# Altium project ECE295 Test Board.PrjPcb
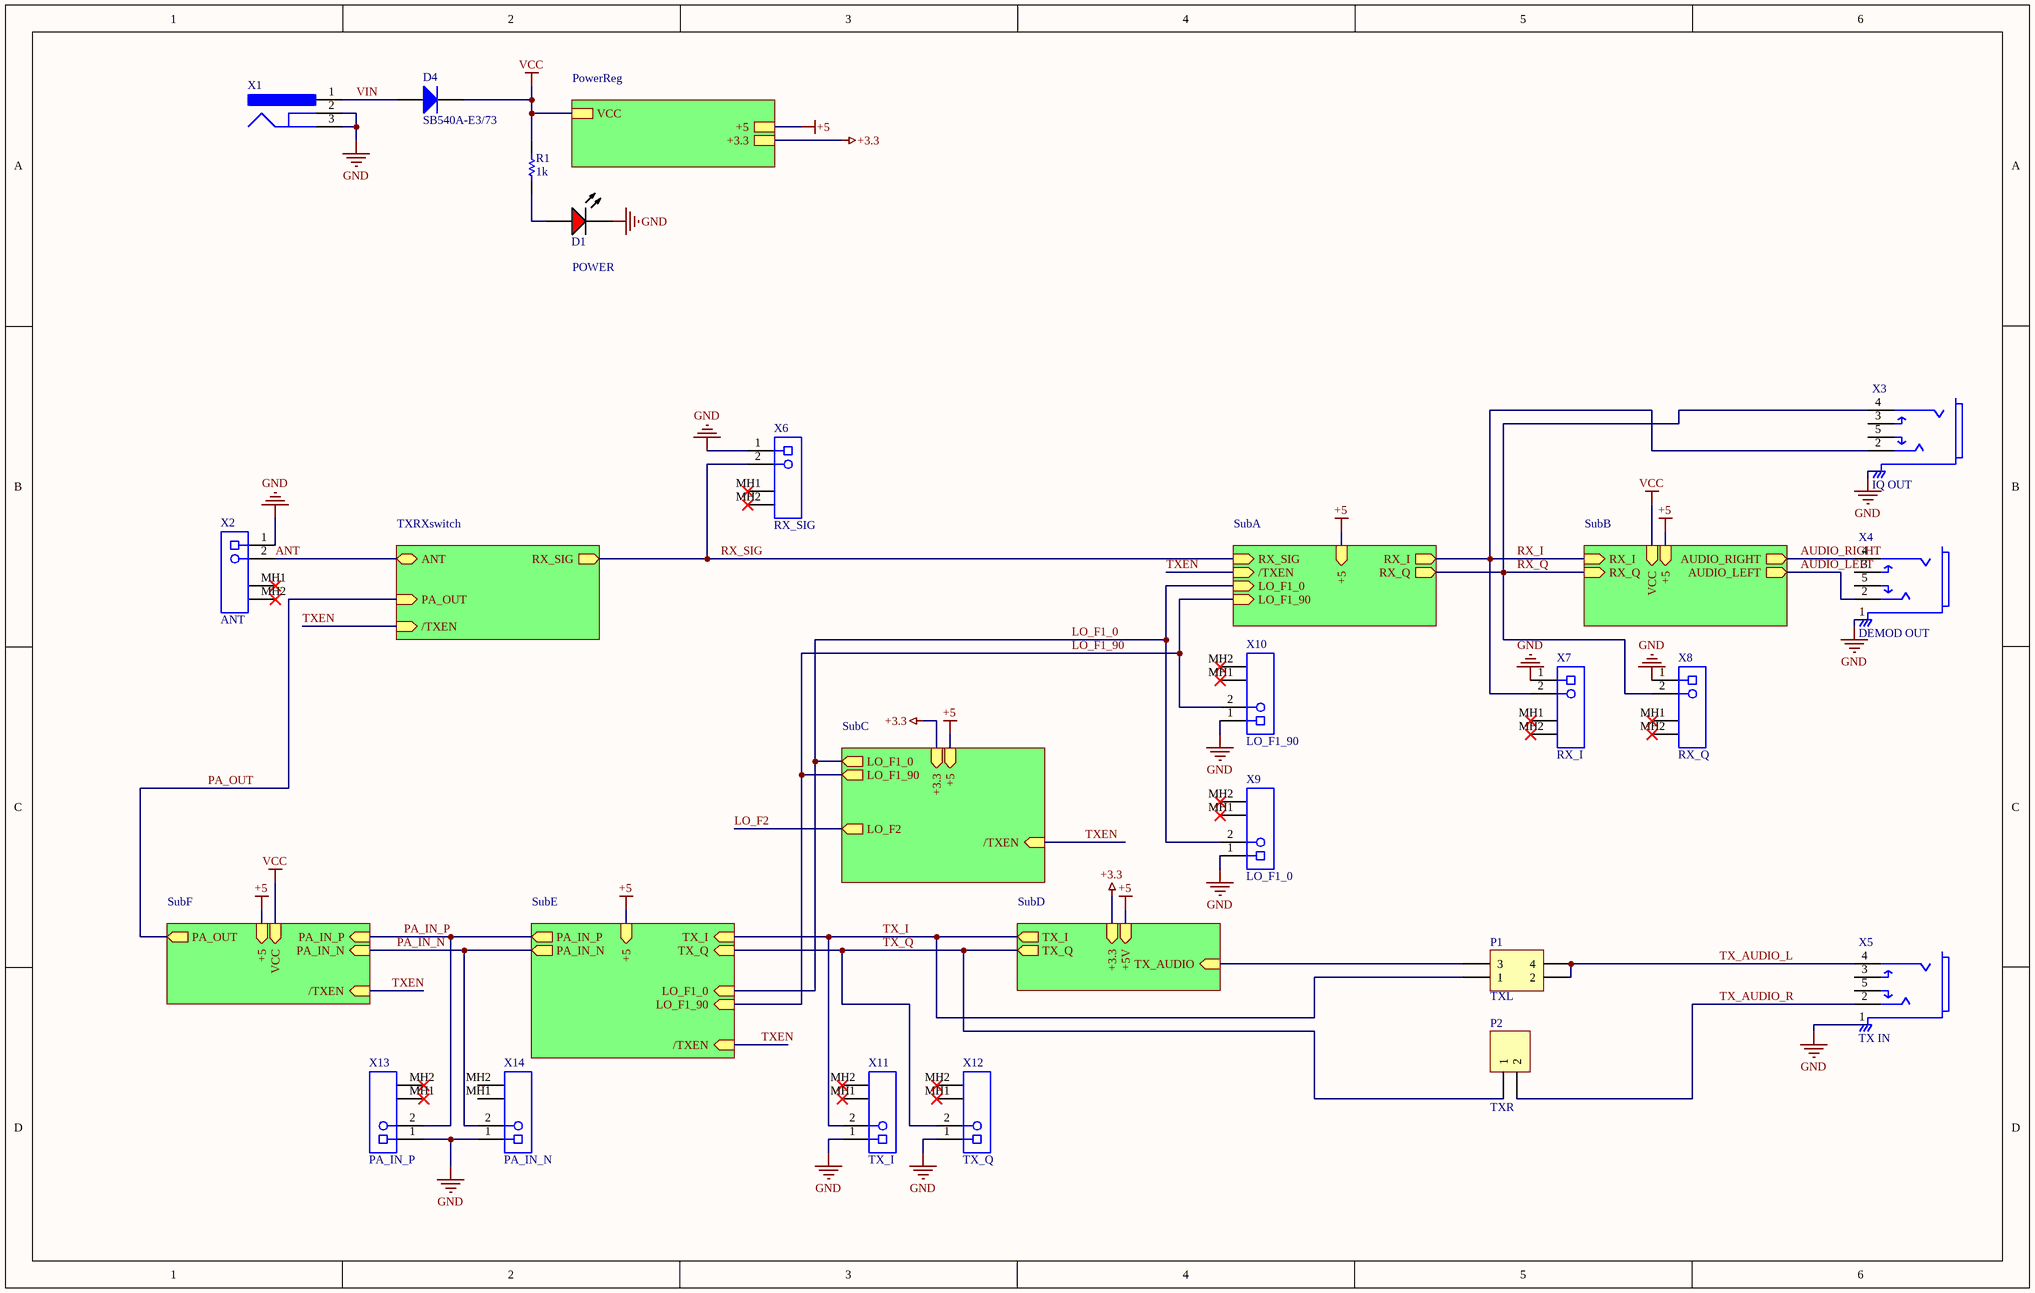
[diagram p0: top_blank.SchDoc]
8 sheets, 39 parts. Net scope: hierarchical (ports join the sheet entries above them; power ports are global).
Board files: top_blank.PcbDoc, demod_blank.PcbDoc, qse_blank.PcbDoc, pa_blank.PcbDoc, osc_blank.PcbDoc, rxall_blank.PcbDoc, modulator.PcbDoc
Sheets:
  top_blank.SchDoc
    SubB = demod_blank.SchDoc
    SubC = osc_blank.SchDoc
    SubF = pa_blank.SchDoc
    SubE = qse_blank.SchDoc
    PowerReg = power_intg.SchDoc
    SubA = rxall_blank.SchDoc
    SubD = modulator.SchDoc

## Sheet top_blank.SchDoc
size 381 x 241 mm; SheetNumber: 1; SheetTotal: 9

### Parts
D1  POWER  [AVAG-HLMP-3301-2]
D4  SB540A-E3/73  [DO-201AD]
P1  TXL  [HDR2X2]
P2  TXR  [HDR1X2]
R1  value 1k  [AXIAL-0.4]  (hidden comment: Res1)
X1  PJ-002A  [CUI-PJ-002A_V]  (value not drawn)
X2  ANT  [TECO-1-1337543-0_V]
X3  IQ OUT  [FP-35RAPC4BV4-MFG]
X4  DEMOD OUT  [FP-35RAPC4BV4-MFG]
X5  TX IN  [FP-35RAPC4BV4-MFG]
X6  RX_SIG  [TECO-1-1337543-0_V]
X7  RX_I  [TECO-1-1337543-0_V]
X8  RX_Q  [TECO-1-1337543-0_V]
X9  LO_F1_0  [TECO-1-1337543-0_V]
X10  LO_F1_90  [TECO-1-1337543-0_V]
X11  TX_I  [TECO-1-1337543-0_V]
X12  TX_Q  [TECO-1-1337543-0_V]
X13  PA_IN_P  [TECO-1-1337543-0_V]
X14  PA_IN_N  [TECO-1-1337543-0_V]

### Sub-sheets
PowerReg = power_intg.SchDoc: VCC, +3.3, +5
SubA = rxall_blank.SchDoc: RX_SIG (in), /TXEN (in), LO_F1_0 (in), LO_F1_90 (in), RX_I (out), +5 (in), RX_Q (out)
SubB = demod_blank.SchDoc: AUDIO_LEFT (out), AUDIO_RIGHT (out), +5 (in), RX_Q (in), RX_I (in), VCC (in)
SubC = osc_blank.SchDoc: /TXEN (in), LO_F1_0 (out), LO_F1_90 (out), LO_F2 (out), +5 (in), +3.3 (in)
SubD = modulator.SchDoc: TX_AUDIO (in), TX_I (out), TX_Q (out), +3.3 (in), +5V (in)
SubE = qse_blank.SchDoc: TX_I (in), TX_Q (in), /TXEN (in), LO_F1_0 (in), LO_F1_90 (in), +5 (in), PA_IN_P (out), PA_IN_N (out)
SubF = pa_blank.SchDoc: PA_OUT (out), /TXEN (in), +5 (in), VCC (in), PA_IN_P (in), PA_IN_N (in)
TXRXswitch = switch_blank.SchDoc (file not in this document): ANT (bidir), RX_SIG (out), /TXEN (in), PA_OUT (in)

### Nets
+3.3: sheet SubC/+3.3, sheet PowerReg/+3.3, sheet SubD/+3.3
+5: sheet SubB/+5, sheet SubC/+5, sheet SubF/+5, sheet SubE/+5, sheet PowerReg/+5, sheet SubA/+5, sheet SubD/+5V
GND: D1.1(K) X1.2 X1.3 X2.1 X3.1 X4.1 X5.1 X6.1 X7.1 X8.1 X9.1 X10.1 X11.1 X12.1 X13.1 X14.1
VCC: D4.2(K) R1.2 ; sheet SubB/VCC, sheet SubF/VCC, sheet PowerReg/VCC
ANT: X2.2 ; sheet TXRXswitch/ANT
AUDIO_LEFT: X4.2 ; sheet SubB/AUDIO_LEFT
AUDIO_RIGHT: X4.4 ; sheet SubB/AUDIO_RIGHT
LO_F1_0: X9.2 ; sheet SubC/LO_F1_0, sheet SubE/LO_F1_0, sheet SubA/LO_F1_0
LO_F1_90: X10.2 ; sheet SubC/LO_F1_90, sheet SubE/LO_F1_90, sheet SubA/LO_F1_90
PA_IN_N: X14.2 ; sheet SubF/PA_IN_N, sheet SubE/PA_IN_N
PA_IN_P: X13.2 ; sheet SubF/PA_IN_P, sheet SubE/PA_IN_P
PA_OUT: sheet SubF/PA_OUT, sheet TXRXswitch/PA_OUT
RX_I: X3.2 X7.2 ; sheet SubB/RX_I, sheet SubA/RX_I
RX_Q: X3.4 X8.2 ; sheet SubB/RX_Q, sheet SubA/RX_Q
RX_SIG: X6.2 ; sheet SubA/RX_SIG, sheet TXRXswitch/RX_SIG
TX_AUDIO_L: P1.2 P1.4 X5.4
TX_AUDIO_R: P2.2 X5.2
TX_I: P1.1 X11.2 ; sheet SubE/TX_I, sheet SubD/TX_I
TX_Q: P2.1 X12.2 ; sheet SubE/TX_Q, sheet SubD/TX_Q
TXEN: sheet SubC//TXEN, sheet SubF//TXEN, sheet SubE//TXEN, sheet SubA//TXEN, sheet TXRXswitch//TXEN
VIN: D4.1(A) X1.1
NetD1_2: D1.2(A) R1.1
NetJ8_1: P1.3 ; sheet SubD/TX_AUDIO

Not connected (* = marked no-connect by the designer): X2 MH1* MH2*; X3 3 5; X4 3 5; X5 3 5; X6 MH1* MH2*; X7 MH1* MH2*; X8 MH1* MH2*; X9 MH1* MH2*; X10 MH1* MH2*; X11 MH1* MH2*; X12 MH1* MH2*; X13 MH1* MH2*; X14 MH1 MH2

### Library data of the parts
D1 = CMP-2000-06411-1: T-1 3/4 (5 mm) Diffused LED Lamp, 1.9 V, -40 to 100 degC, 2-Pin THD, RoHS, Bulk; Manufacturer: Avago; Forward Current: 25mA; Forward Voltage: 2.4V; Peak Wavelength: 635nm; Shape Type: Circular; High Brightness: No; Main Category: StandardLED; Test Current (It): 10mA; Dominant Wave Length: 626nm; Number of  Elements: 1; Reverse Voltage: 5V; Chip Material: GaP; Product Height (mm): 9.19mm; Lens Type: ColoredDiffused; Viewing Angle: 60deg; Type: Uni-Color; Emitting Color: Red; Luminous Intensity: 5.4mcd; Power Dissipation: 85W; DELETED: Compliant; Product Depth (mm): 6.1mm; Package Description: 2-Pin Through Hole LED, Dia 5.85 mm; Mounting Technology: ThroughHole; Manufacturer URL: http://www.avagotech.com/; Package Type: T-13/4; Operating Temp Range: -40Cto100C; Datasheet URL: http://www.avagotech.com/docs/AV02-1558EN; Mounting: ThroughHole; Lens Dimensions: 5.08x5.08x8.3mm; Package Reference: HLMP-3301; Datasheet Version: 03/2015; Pin Count: 2; Packaging: TapeandReel; Operating Temperature Classification: Industrial; Lum Intensity: 5.4mcd; Rad Hardened: No; Product Length (mm): 6.1mm
D4 = Diode 1N5408: 3 Amp Medium Power Silicon Rectifier Diode; Published: 8-Jun-2000; LatestRevisionDate: 17-Jul-2002; LatestRevisionNote: Re-released for DXP Platform.; DatasheetVersion: Aug-1984; PackageReference: DO-201AD; Publisher: Altium Limited; PackageDescription: Diode, Axial; Body 9.5 x 5.3 mm (LxDia. max), Lead Dia. 1.32 mm (max); ComponentLink1Description: Manufacturer Link; ComponentLink1URL: http://www.irf.com/
P1 = Header 2X2: Header, 2-Pin, Dual row; LatestRevisionDate: 17-Jul-2002; LatestRevisionNote: Re-released for DXP Platform.; Publisher: Altium Limited
P2 = Header 2: Header, 2-Pin; LatestRevisionDate: 17-Jul-2002; LatestRevisionNote: Re-released for DXP Platform.; Publisher: Altium Limited
R1 = Res1: Resistor; Published: 8-Jun-2000; LatestRevisionDate: 17-Jul-2002; LatestRevisionNote: Re-released for DXP Platform.; PackageReference: AXIAL-0.3; Publisher: Altium Limited; PackageDescription: Axial Device, Thru-Hole; 2 Leads; 0.3 in Pin Spacing
X1 = CMP-2000-06895-1: Through Hole Right Angle DC Power Jack, 2.5 A, 2 mm Center Pin, 3 Position, -25 to 85 degC, RoHS, Bulk; Manufacturer: CUIInc.; Current Rating: 2.5A; Inside Contact Diameter: 2mm; Insulation Resistance: 50MOhms; Outside Contact Diameter: 6.5mm; Voltage Rating: 24V; Brand: CUI; Operating Temperature Range: -25Cto+85C; Mounting Technology: ThroughHole; Connector Type: DCPowerJack; Contact Material: Copper; Datasheet URL: http://www.cui.com/product/resource/pj-002a.pdf; Contact Gender: Male; Housing Material: PolybutyleneTerephthalate(PBT); Manufacturer URL: http://www.cui.com/; Package Reference: PJ-002A; Mounting Style: ThroughHole; Mounting Angle: Right; Product Category: DCPowerConnectors; Product: Jacks; Flammability Rating: UL94V-0; Contact Plating: Nickel; RoHS: True; Datasheet Version: Rev. 1.03, 04/2016; Package Description: 3-Pin Through Hole Device, Body 14.4 x 9 mm, Height 11 mm; Factory Pack Quantity: 500; Termination Style: ThroughHole
X2 X6-X14 = CMP-2000-05853-1: Female Connector, Pitch 2.54 mm, 1 x 2 Position, Height 15.8 mm, Tail Length 3.8 mm, / -55 to 85 degC, RoHS, Bulk; Manufacturer: TE Connectivity; Connector Body Style: RightAngleJack; Frequency Max: 4GHz; Coaxial Termination: Solder; Connector Mounting: PCBMount; SVHC: ToBeAdvised; Connector Type: BNCCoaxial; Impedance: 50ohm; Coaxial Cable Types: -; Manufacturer URL: http://www.te.com/; Package Reference: 1-1337543-0; Product Range: -; Datasheet URL: http://www.te.com/commerce/DocumentDelivery/DDEController?Action=showdoc&DocId=Customer+Drawing%7F1337543%7FG%7Fpdf%7FEnglish%7FENG_CD_1337543_G.pdf%7F1-1337543-0; Contact Plating: GoldPlatedContacts; Mounting Technology: ThroughHole; Package Description: Female Connector, Pitch 2.54 mm, 1 x 2 Position, Height 15.8 mm, Tail Length 3.8 mm; Contact Material: Brass; Datasheet Version: Rev. G, 12/2012
X3-X5 = CMP-47983-000001-1: CONN JACK STEREO 3.5MM R/A; Manufacturer: Switchcraft; Obsolete Part: true; Manufacturer Part Number: 35RAPC4BV4; Conn Orientation: Right Angle; Number Of Contacts: 5; Contact Material: Silver; Device Class L1: Connectors; Height: 0.495inch; ComponentLink2URL: http://www.switchcraft.com/Drawings/35rapc__v4_cd.pdf; Category: Conn; Digikey Description: CONN JACK STEREO 3.5MM R/A; Automotive: No; ComponentLink2Description: Datasheet; Package: 35RAPC4BV4; Device Class L2: Audio / Video Connectors; Mouser Description: Phone Connectors 3.5MM VERT STEREO JK; RoHS: TRUE; Octopart: https://octopart.com/35rapc4bv4-switchcraft-223606; Lead Free: Yes; Device Class L3: unset

## Sheet demod_blank.SchDoc
size Letter; SheetNumber: 13; SheetTotal: 13
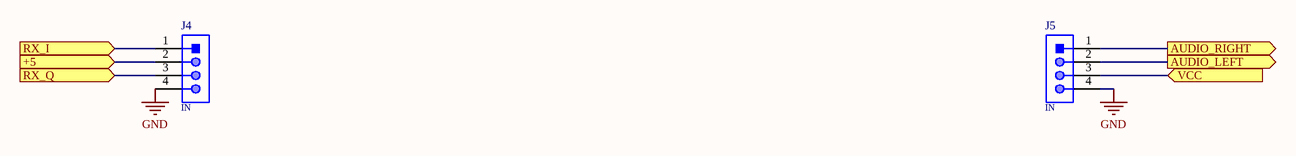
[diagram p1: demod_blank.SchDoc]

### Parts
(Parts that share a designator on the sheet are numbered #1, #2 ... from top to bottom, then left to right.)
J4  IN  [61300411121]
J5#1  IN  [61300411121]

### Ports
+5 (in), AUDIO_LEFT (out), AUDIO_RIGHT (out), RX_I (in), RX_Q (in), VCC (in)

### Nets
+5: J4.2 ; port +5
GND: J4.4 J5#1.4
VCC: J5#1.3 ; port VCC
AUDIO_LEFT: J5#1.2 ; port AUDIO_LEFT
AUDIO_RIGHT: J5#1.1 ; port AUDIO_RIGHT
RX_I: J4.1 ; port RX_I
RX_Q: J4.3 ; port RX_Q

### Library data of the parts
J4 J5#1 = CMP-1502-01064-1: THT Vertical Pin Header WR-PHD, Pitch 2.54 mm, Single Row, 4 pins; Manufacturer: Wurth Elektronik; Withstanding Voltage: 500VAC; Rated Current: 3A; Working Voltage: 250VAC; Pin Number: 4; Gender: Male; Contact Resistance: 20mOhm; Pitch: 2.54mm; Manufacturer URL: http://www.we-online.de; Operating Temperature: -40to105degC; Packaging: Bag; Mounting Technology: THT; Package Reference: 61300411121; Datasheet URL: https://katalog.we-online.de/em/datasheet/6130xx11121.pdf; Publisher: WurthElektronik; Part Number: 61300411121; Row Number: Single; Orientation: Vertical

## Sheet osc_blank.SchDoc
size Letter; SheetNumber: 5; SheetTotal: 9
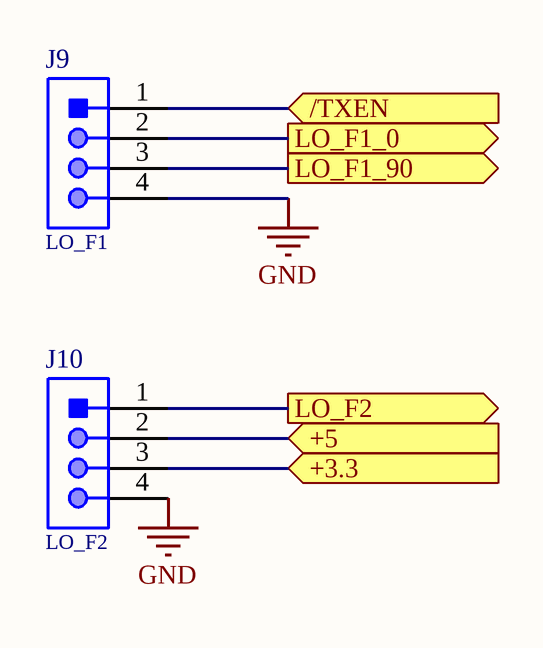
[diagram p2: osc_blank.SchDoc]

### Parts
(Parts that share a designator on the sheet are numbered #1, #2 ... from top to bottom, then left to right.)
J9#1  LO_F1  [61300411121]
J10#1  LO_F2  [61300411121]

### Ports
+3.3 (in), +5 (in), /TXEN (in), LO_F1_0 (out), LO_F1_90 (out), LO_F2 (out)

### Nets
+3.3: J10#1.3 ; port +3.3
+5: J10#1.2 ; port +5
GND: J9#1.4 J10#1.4
LO_F1_0: J9#1.2 ; port LO_F1_0
LO_F1_90: J9#1.3 ; port LO_F1_90
LO_F2: J10#1.1 ; port LO_F2
TXEN: J9#1.1 ; port /TXEN

### Library data of the parts
J9#1 J10#1 = CMP-1502-01064-1: as J4 on sheet demod_blank; Manufacturer URL: http://www.we-online.de; Operating Temperature: -40to105degC; Packaging: Bag; Mounting Technology: THT; Package Reference: 61300411121; Datasheet URL: https://katalog.we-online.de/em/datasheet/6130xx11121.pdf; Publisher: WurthElektronik; Part Number: 61300411121; Row Number: Single; Orientation: Vertical

## Sheet pa_blank.SchDoc
size Letter; SheetNumber: 16; SheetTotal: 16
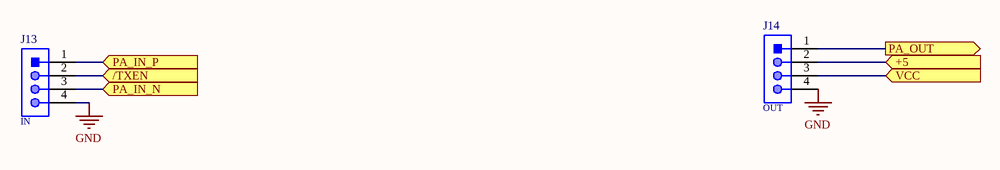
[diagram p3: pa_blank.SchDoc]

### Parts
J13  IN  [61300411121]
J14  OUT  [61300411121]

### Ports
+5 (in), /TXEN (in), PA_IN_N (in), PA_IN_P (in), PA_OUT (out), VCC (in)

### Nets
+5: J14.2 ; port +5
GND: J13.4 J14.4
VCC: J14.3 ; port VCC
PA_IN_N: J13.3 ; port PA_IN_N
PA_IN_P: J13.1 ; port PA_IN_P
PA_OUT: J14.1 ; port PA_OUT
TXEN: J13.2 ; port /TXEN

### Library data of the parts
J13 J14 = CMP-1502-01064-1: as J4 on sheet demod_blank; Manufacturer URL: http://www.we-online.de; Operating Temperature: -40to105degC; Packaging: Bag; Mounting Technology: THT; Package Reference: 61300411121; Datasheet URL: https://katalog.we-online.de/em/datasheet/6130xx11121.pdf; Publisher: WurthElektronik; Part Number: 61300411121; Row Number: Single; Orientation: Vertical

## Sheet qse_blank.SchDoc
size Letter; SheetNumber: 4; SheetTotal: 9
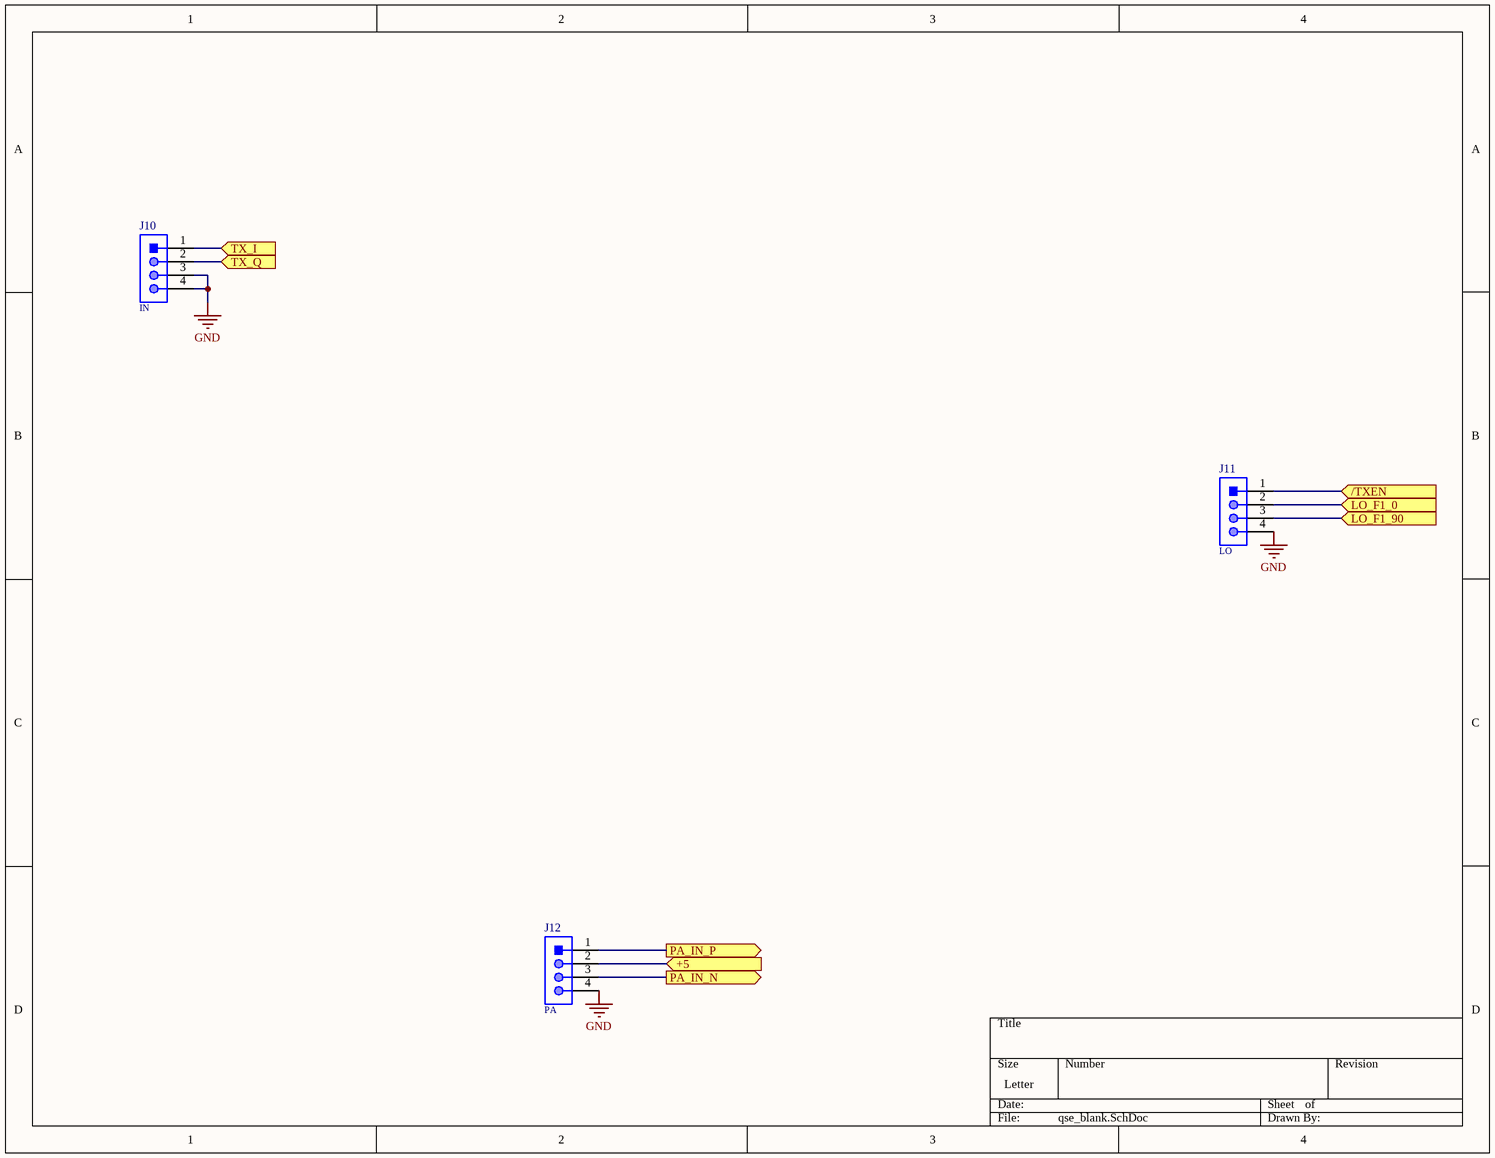
[diagram p4: qse_blank.SchDoc]

### Parts
(Parts that share a designator on the sheet are numbered #1, #2 ... from top to bottom, then left to right.)
J10#2  IN  [61300411121]
J11  LO  [61300411121]
J12  PA  [61300411121]

### Ports
+5 (in), /TXEN (in), LO_F1_0 (in), LO_F1_90 (in), PA_IN_N (out), PA_IN_P (out), TX_I (in), TX_Q (in)

### Nets
+5: J12.2 ; port +5
GND: J10#2.3 J10#2.4 J11.4 J12.4
LO_F1_0: J11.2 ; port LO_F1_0
LO_F1_90: J11.3 ; port LO_F1_90
PA_IN_N: J12.3 ; port PA_IN_N
PA_IN_P: J12.1 ; port PA_IN_P
TX_I: J10#2.1 ; port TX_I
TX_Q: J10#2.2 ; port TX_Q
TXEN: J11.1 ; port /TXEN

### Library data of the parts
J10#2 J11 J12 = CMP-1502-01064-1: as J4 on sheet demod_blank; Manufacturer URL: http://www.we-online.de; Operating Temperature: -40to105degC; Packaging: Bag; Mounting Technology: THT; Package Reference: 61300411121; Datasheet URL: https://katalog.we-online.de/em/datasheet/6130xx11121.pdf; Publisher: WurthElektronik; Part Number: 61300411121; Row Number: Single; Orientation: Vertical

## Sheet power_intg.SchDoc
size Letter
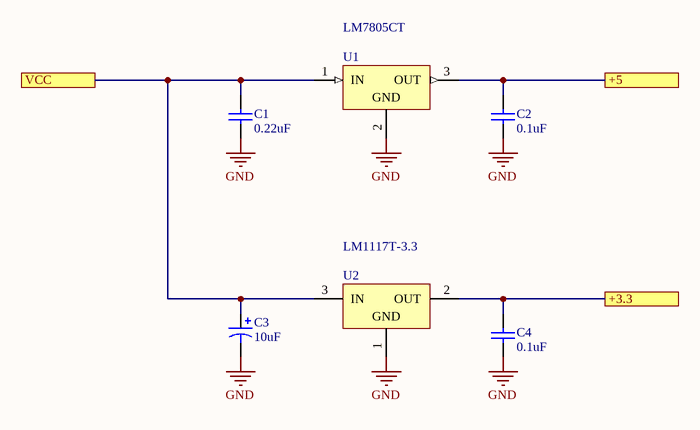
[diagram p5: power_intg.SchDoc]

### Parts
C1  value 0.22uF  [RAD-0.1]  (hidden comment: Cap)
C2  value 0.1uF  [RAD-0.1]  (hidden comment: Cap)
C3  value 10uF  [RAD-0.1]  (hidden comment: Cap Pol1)
C4  value 0.1uF  [RAD-0.1]  (hidden comment: Cap)
U1  LM7805CT  [FAIR-TO-220-3]
U2  LM1117T-3.3  [T03B]

### Ports
+3.3, +5, VCC

### Nets
+3.3: C4.1 U2.2(OUT) ; port +3.3
+5: C2.1 U1.3(OUT) ; port +5
GND: C1.2 C2.2 C3.2 C4.2 U1.2(GND) U2.1(GND)
VCC: C1.1 C3.1 U1.1(IN) U2.3(IN) ; port VCC

### Library data of the parts
C1 C2 C4 = Cap: Capacitor; Published: 8-Jun-2000; LatestRevisionDate: 17-Jul-2002; LatestRevisionNote: Re-released for DXP Platform.; PackageReference: RAD-0.3; Publisher: Altium Limited; PackageDescription: Radial Cap, Thru-Hole; 2 Leads; 0.3 in Pin Spacing
C3 = Cap Pol1: Polarized Capacitor (Radial); Published: 8-Jun-2000; LatestRevisionDate: 17-Jul-2002; LatestRevisionNote: Re-released for DXP Platform.; PackageReference: RB7.6-15; Publisher: Altium Limited; PackageDescription: Polarized Capacitor (Radial); 2 Leads
U1 = CMP-2000-04938-1: Positive Voltage Regulator, 5 V, 1 A, -40 to 125 degC, 3-Pin TO-220, RoHS, Tube; Manufacturer: FairchildSemiconductor; Maximum Input Voltage: 35V; Maximum Quiescent Current: 8mA; Load Regulation: 100mV; Maximum Output Current: 2.2(Typ)A; Output Type: Fixed; Typical Dropout Voltage @ Current: 2@1AV; Rad Hard: No; Output Voltage: 5V; Accuracy: ±4%; Number of Outputs: 1; Category: LinearRegulator; Package Description: 3-Pin Through Hole Device, Body 10 x 4.5 mm, Pitch 2.54 mm; Packaging: Rail/Tube; Mounting: ThroughHole; Polarity: Positive; Manufacturer URL: https://www.fairchildsemi.com/; Line Regulation: 100mV; Datasheet Version: Aug-12; Datasheet URL: https://datasheet.ciiva.com/26904/lm7805ct-26904988.pdf; Package Reference: TO-220; Package URL: https://www.fairchildsemi.com/package-drawings/TO/TO220B03.pdf; Package: 3TO-220AB; Operating Temperature: -40to125degC; Type: Linear
U2 = CMP-0062-02490-2: 800mA Low-Dropout Linear Regulator, 3-pin TO-220; Manufacturer: National Semiconductor; PowerWise: N; CompType: LDO IC; PackageTopMarking: NSUZXYTTE#*LM1117T*3.3; ComponentLink1Description: LM1117 Datasheet; RoHS: N; PinCount: 3; DatasheetVersion: Apr-2006; PackageDescription: TO-220, Molded, 3 Lead, Straight; ComponentLink2URL: http://www.national.com/pf/LM/LM1117.html; ComponentLink2Description: LM1117 Web Page; RevisionNote: Component URLs added; ComponentLink3Description: T03B Package Page; PackageReference: T03B; ComponentLink1URL: http://www.national.com/ds/LM/LM1117.pdf; PackageVersion: revL, Jan-1992; ComponentLink3URL: http://www.national.com/packaging/folders/t03b.html

## Sheet rxall_blank.SchDoc
size A4
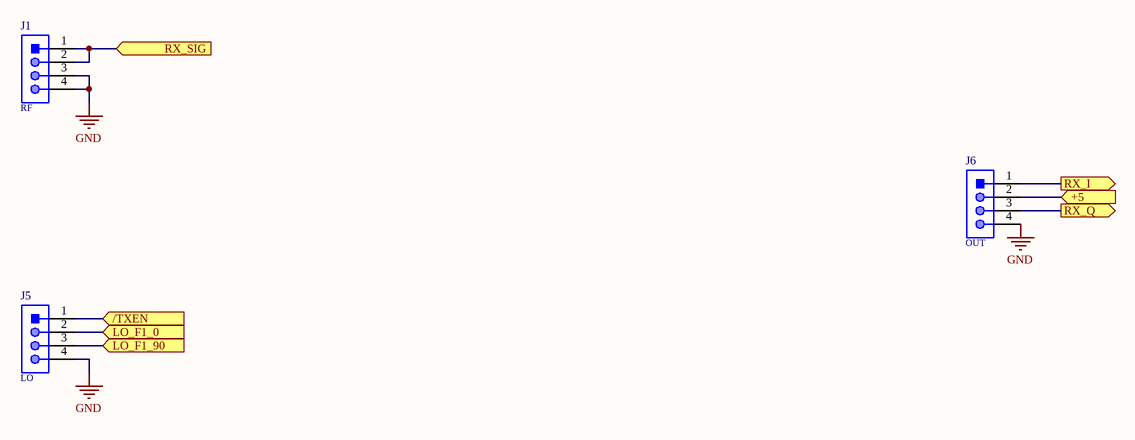
[diagram p6: rxall_blank.SchDoc]

### Parts
(Parts that share a designator on the sheet are numbered #1, #2 ... from top to bottom, then left to right.)
J1  RF  [61300411121]
J5#2  LO  [61300411121]
J6  OUT  [61300411121]

### Ports
+5 (in), /TXEN (in), LO_F1_0 (in), LO_F1_90 (in), RX_I (out), RX_Q (out), RX_SIG (in)

### Nets
+5: J6.2 ; port +5
GND: J1.3 J1.4 J5#2.4 J6.4
LO_F1_0: J5#2.2 ; port LO_F1_0
LO_F1_90: J5#2.3 ; port LO_F1_90
RX_I: J6.1 ; port RX_I
RX_Q: J6.3 ; port RX_Q
RX_SIG: J1.1 J1.2 ; port RX_SIG
TXEN: J5#2.1 ; port /TXEN

### Library data of the parts
J1 J5#2 J6 = CMP-1502-01064-1: as J4 on sheet demod_blank; Manufacturer URL: http://www.we-online.de; Operating Temperature: -40to105degC; Packaging: Bag; Mounting Technology: THT; Package Reference: 61300411121; Datasheet URL: https://katalog.we-online.de/em/datasheet/6130xx11121.pdf; Publisher: WurthElektronik; Part Number: 61300411121; Row Number: Single; Orientation: Vertical

## Sheet modulator.SchDoc
size A4
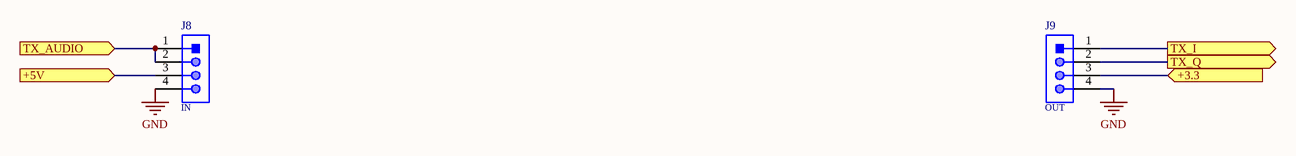
[diagram p7: modulator.SchDoc]

### Parts
(Parts that share a designator on the sheet are numbered #1, #2 ... from top to bottom, then left to right.)
J8  IN  [61300411121]
J9#2  OUT  [61300411121]

### Ports
+3.3 (in), +5V (in), TX_AUDIO (in), TX_I (out), TX_Q (out)

### Nets
+3.3: J9#2.3 ; port +3.3
+5: J8.3 ; port +5V
GND: J8.4 J9#2.4
TX_I: J9#2.1 ; port TX_I
TX_Q: J9#2.2 ; port TX_Q
NetJ8_1: J8.1 J8.2 ; port TX_AUDIO

### Library data of the parts
J8 J9#2 = CMP-1502-01064-1: as J4 on sheet demod_blank; Manufacturer URL: http://www.we-online.de; Operating Temperature: -40to105degC; Packaging: Bag; Mounting Technology: THT; Package Reference: 61300411121; Datasheet URL: https://katalog.we-online.de/em/datasheet/6130xx11121.pdf; Publisher: WurthElektronik; Part Number: 61300411121; Row Number: Single; Orientation: Vertical

## Nets that join several sheets
+3.3: osc_blank (J10#1.3), power_intg (C4.1 U2.2), modulator (J9#2.3)
+5: demod_blank (J4.2), osc_blank (J10#1.2), pa_blank (J14.2), qse_blank (J12.2), power_intg (C2.1 U1.3), rxall_blank (J6.2), modulator (J8.3)
GND: top_blank (16 pins), demod_blank (J4.4 J5#1.4), osc_blank (J9#1.4 J10#1.4), pa_blank (J13.4 J14.4), qse_blank (J10#2.3 J10#2.4 J11.4 J12.4), power_intg (6 pins), rxall_blank (J1.3 J1.4 J5#2.4 J6.4), modulator (J8.4 J9#2.4)
VCC: top_blank (D4.2 R1.2), demod_blank (J5#1.3), pa_blank (J14.3), power_intg (C1.1 C3.1 U1.1 U2.3)
AUDIO_LEFT: top_blank (X4.2), demod_blank (J5#1.2)
AUDIO_RIGHT: top_blank (X4.4), demod_blank (J5#1.1)
LO_F1_0: top_blank (X9.2), osc_blank (J9#1.2), qse_blank (J11.2), rxall_blank (J5#2.2)
LO_F1_90: top_blank (X10.2), osc_blank (J9#1.3), qse_blank (J11.3), rxall_blank (J5#2.3)
NetJ8_1: top_blank (P1.3), modulator (J8.1 J8.2)
PA_IN_N: top_blank (X14.2), pa_blank (J13.3), qse_blank (J12.3)
PA_IN_P: top_blank (X13.2), pa_blank (J13.1), qse_blank (J12.1)
RX_I: top_blank (X3.2 X7.2), demod_blank (J4.1), rxall_blank (J6.1)
RX_Q: top_blank (X3.4 X8.2), demod_blank (J4.3), rxall_blank (J6.3)
RX_SIG: top_blank (X6.2), rxall_blank (J1.1 J1.2)
TX_I: top_blank (P1.1 X11.2), qse_blank (J10#2.1), modulator (J9#2.1)
TX_Q: top_blank (P2.1 X12.2), qse_blank (J10#2.2), modulator (J9#2.2)
TXEN: osc_blank (J9#1.1), pa_blank (J13.2), qse_blank (J11.1), rxall_blank (J5#2.1)